# EAGLE board trailmon (EAGLE 7.5.0)
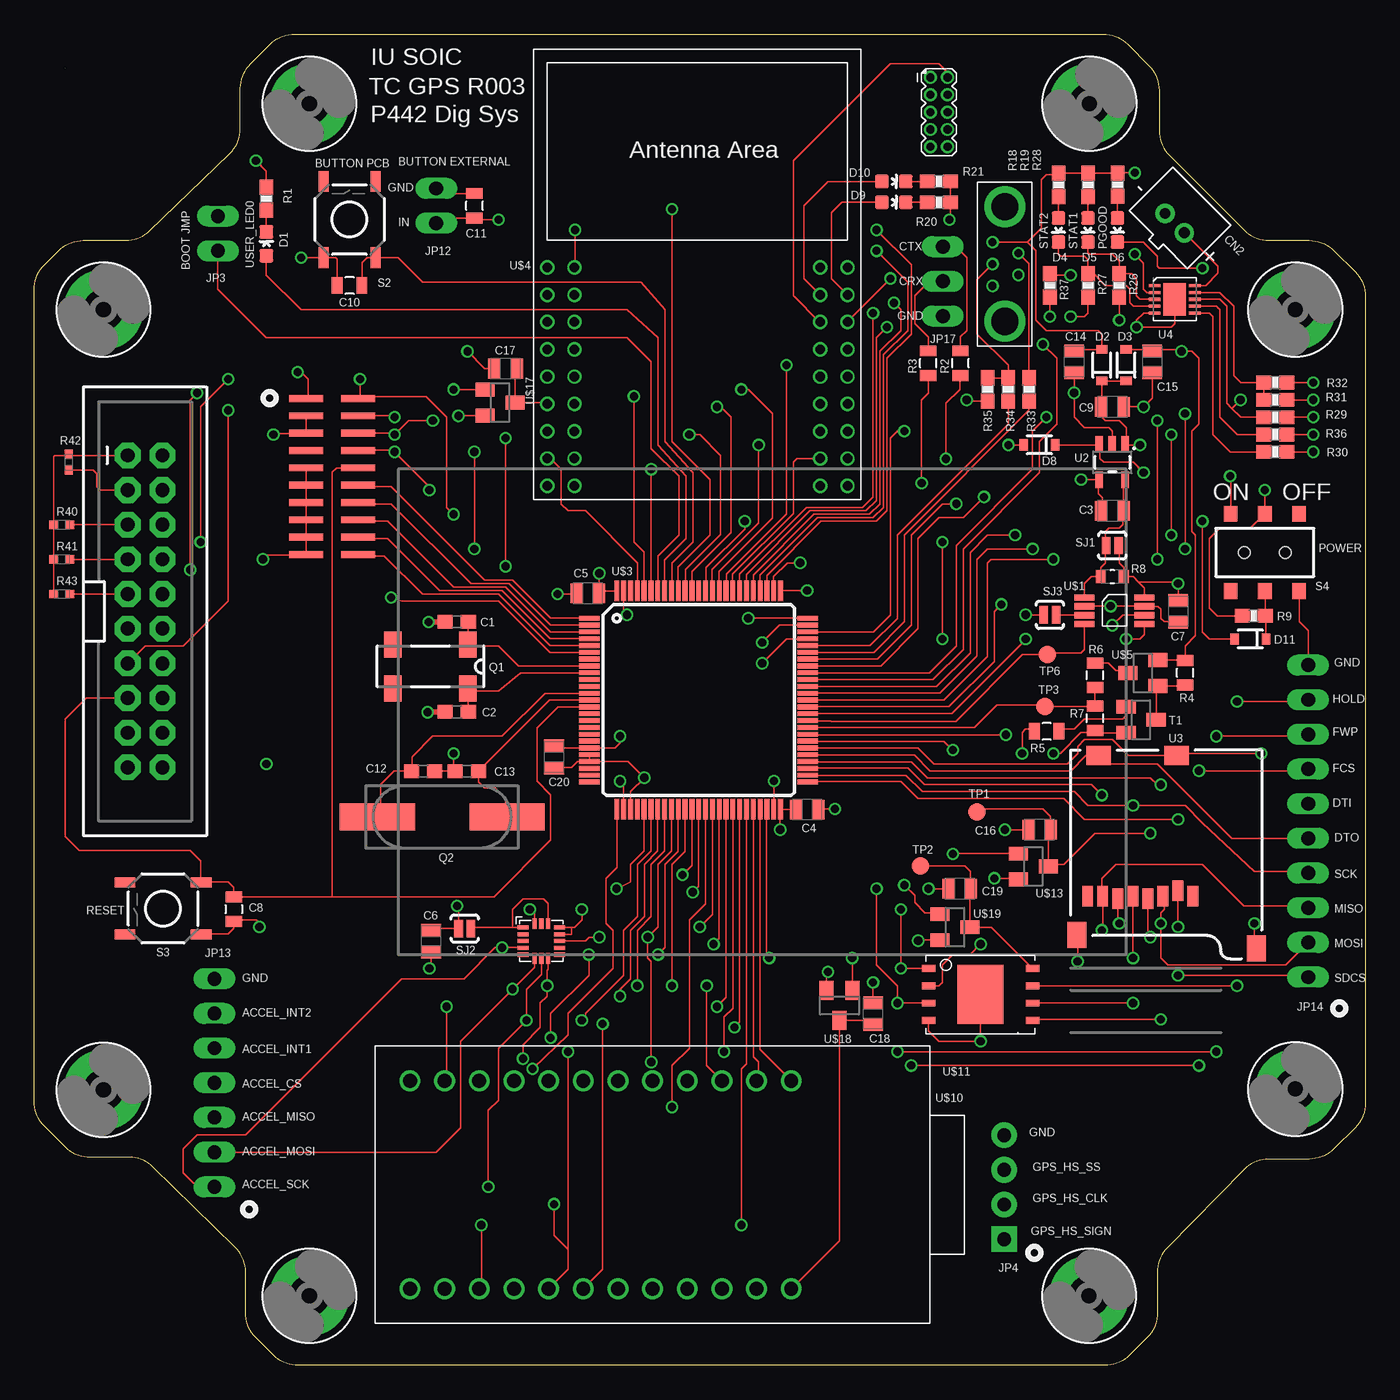
[diagram p7: board, top side]
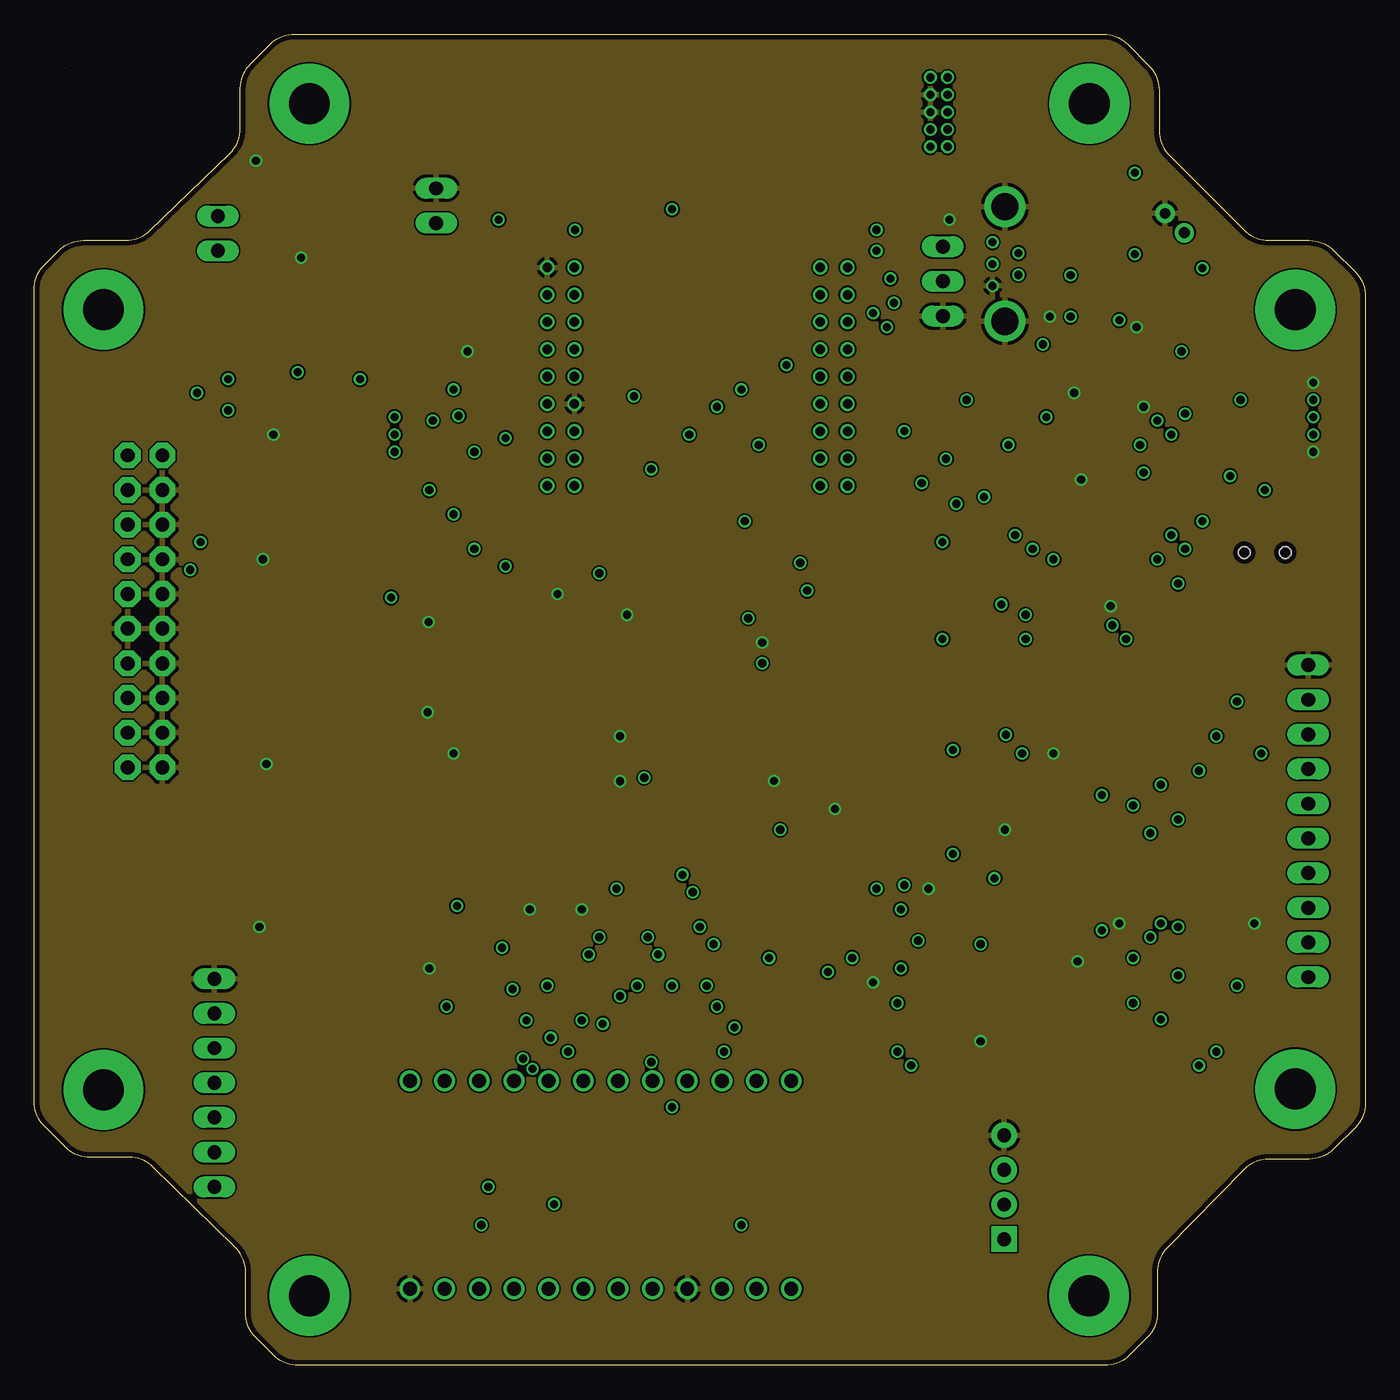
[diagram p8: board, inner layer Route2]
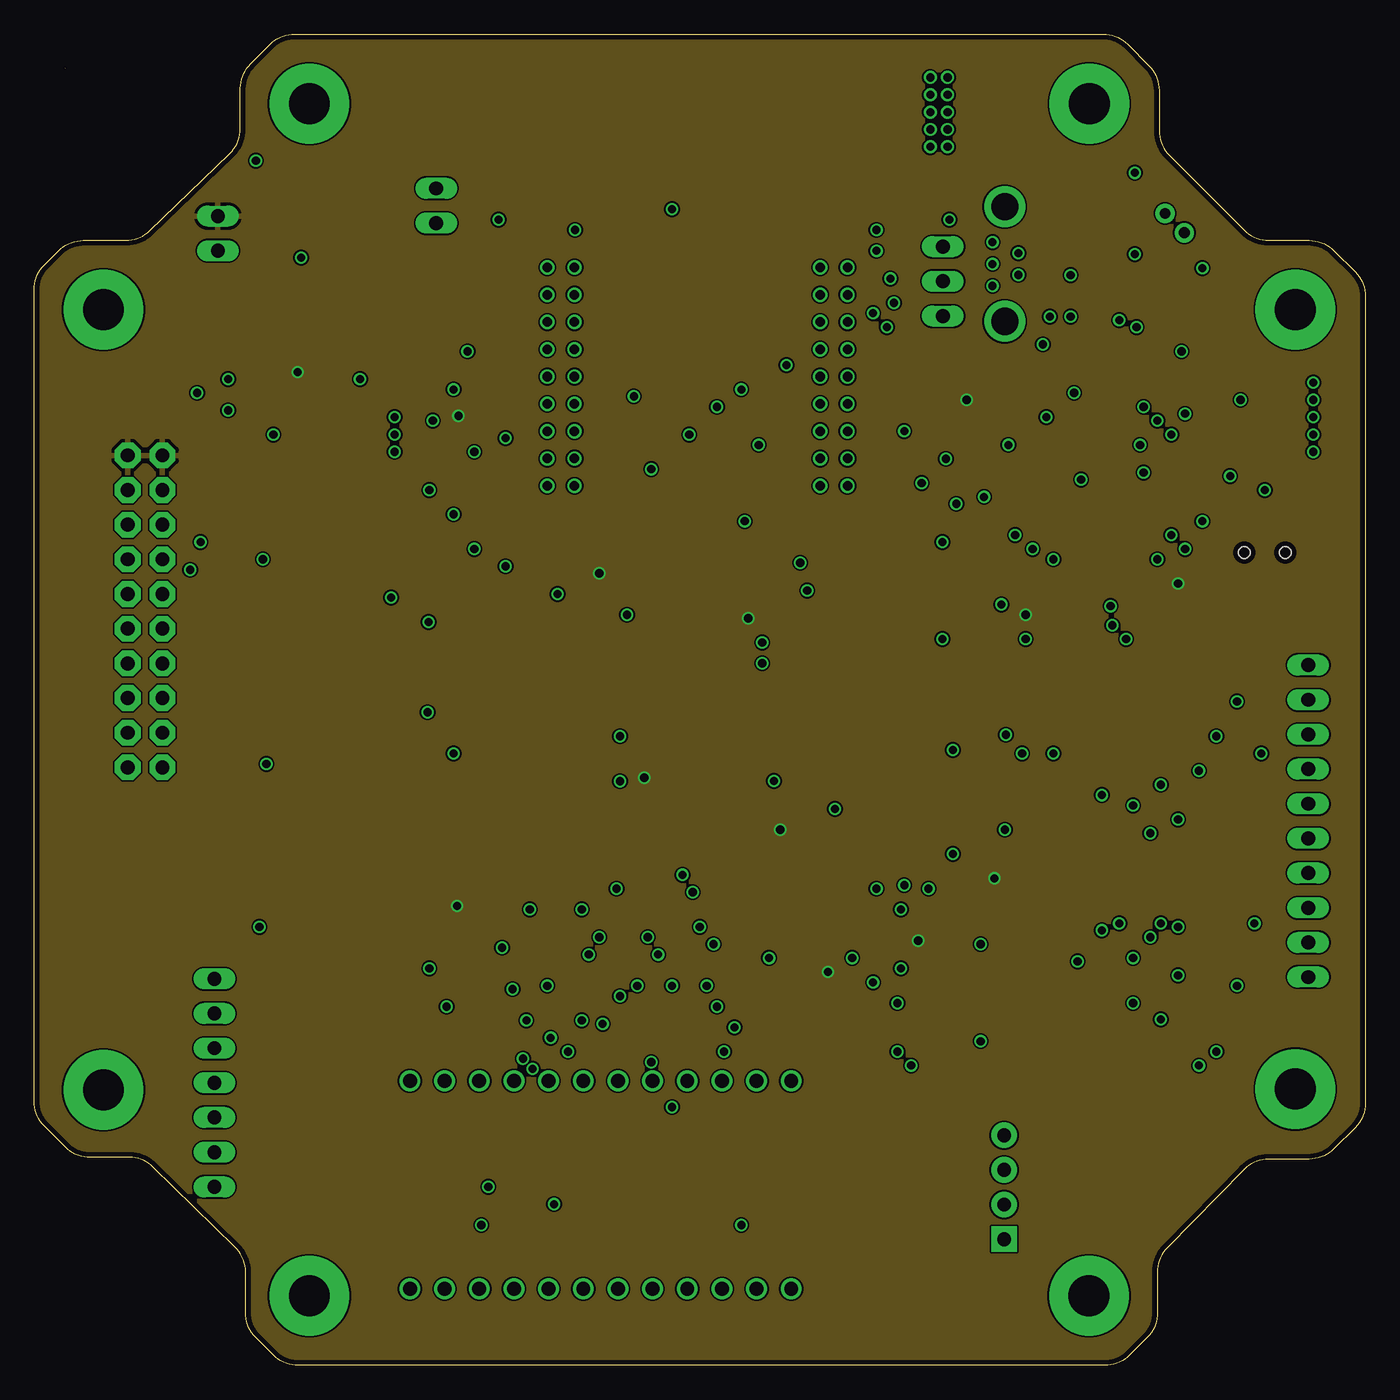
[diagram p9: board, inner layer Route15]
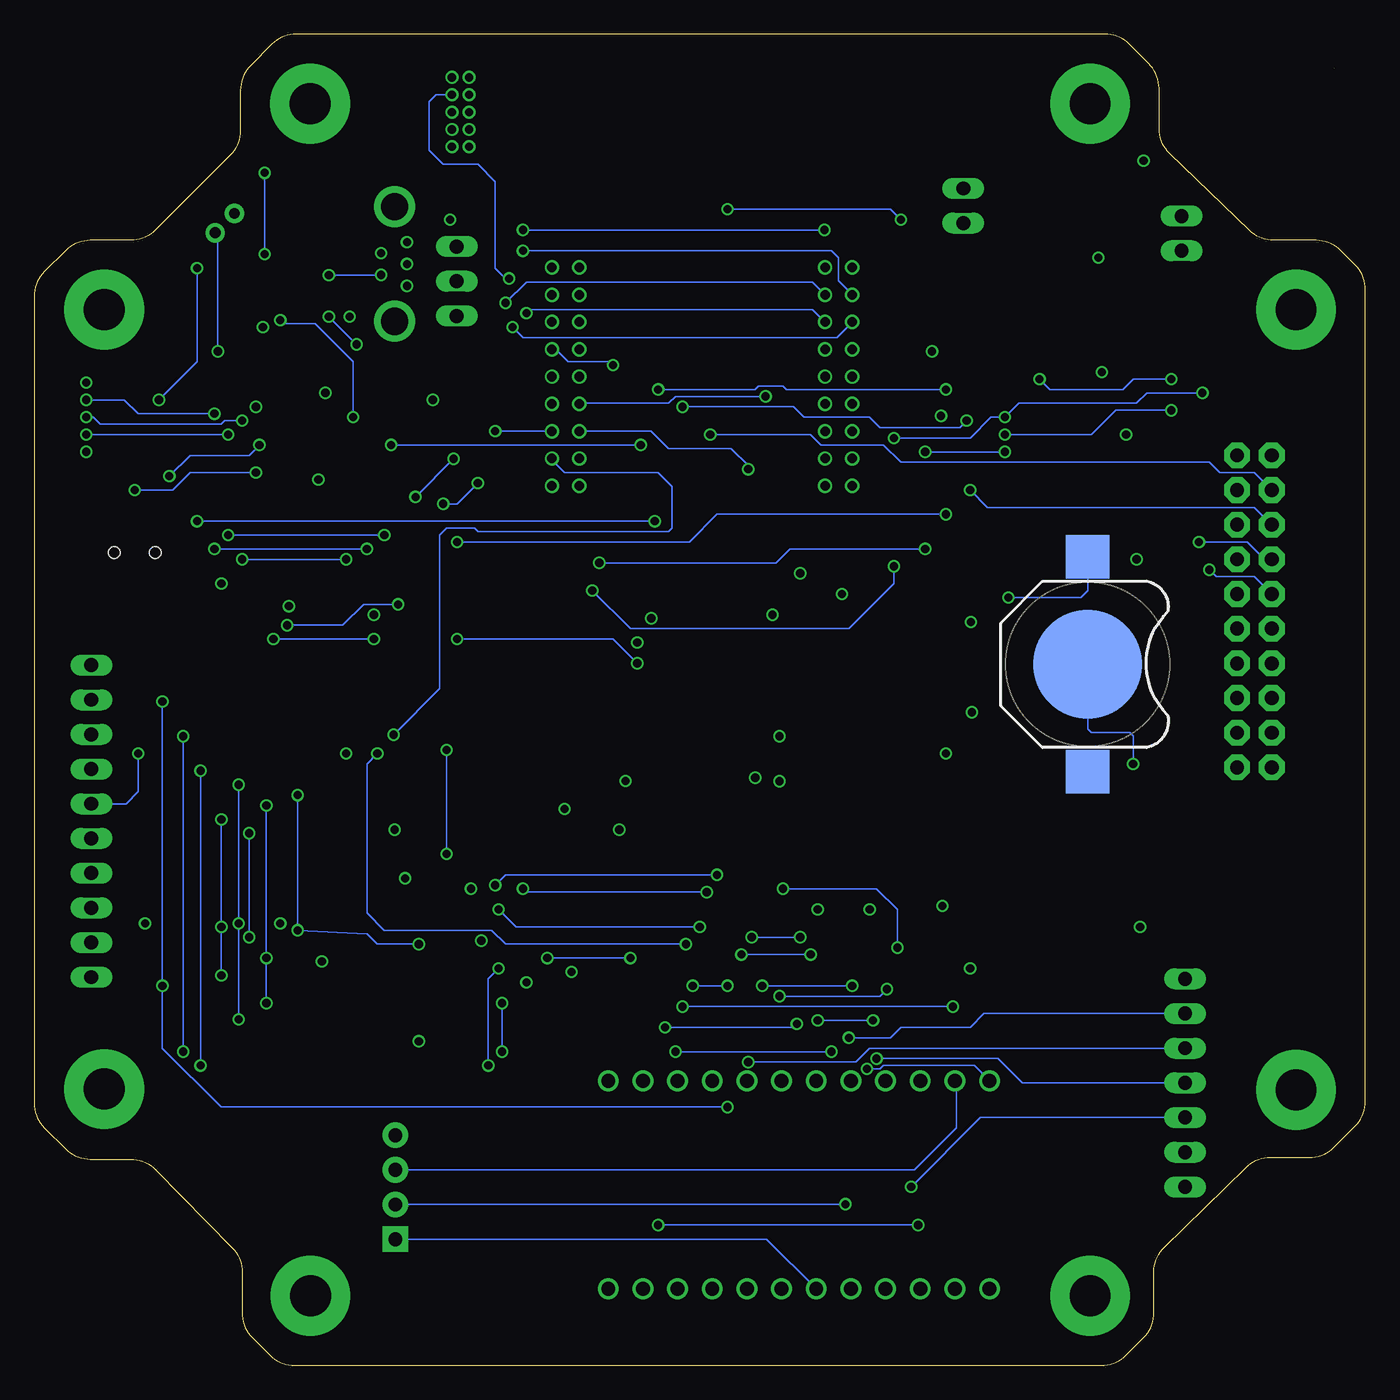
[diagram p10: board, bottom side, seen from below]

Size 97.54 x 97.54 mm. Coordinates in mm from the lower left corner, seen from the top.
Outline: 2.29,95.05 arc0 2.29,95.05
Outline: 83.17,88.66 88.66,83.17 arc45 90.46,82.42 93.44,82.42 arc-45 95.23,81.68 96.79,80.12 arc-45 97.54,78.32 97.54,19.21 arc-45 96.79,17.42 95.23,15.86 arc-45 93.44,15.11 90.46,15.11 arc45 88.66,14.37 88.66,14.36 arc1 88.64,14.34 83.02,8.62 arc44 82.3,6.84 82.3,3.85 arc-45 81.55,2.05 80.25,0.74 arc-45 78.45,0 19.34,0 arc-45 17.54,0.74 16.24,2.05 arc-45 15.49,3.85 15.49,6.84 arc46 14.73,8.65 8.74,14.52 arc44 6.96,15.24 4.1,15.24 arc-45 2.3,15.98 0.74,17.54 arc-45 0,19.34 0,78.83 arc-45 0.74,80.63 1.8,81.68 arc-45 3.59,82.42 6.72,82.42 arc44 8.48,83.14 14.34,88.79 arc46 15.11,90.61 15.11,93.56 arc-45 15.86,95.36 17.29,96.79 arc-45 19.09,97.54 78.32,97.54 arc-45 80.12,96.79 81.68,95.23 arc-45 82.42,93.44 82.42,90.46 arc45 83.17,88.66
Copper layers (1*2*15*16): Top 0.035559375mm / dielectric 0.17018125mm / Route2 0.01778125mm / dielectric 47mil / Route15 0.01778125mm / dielectric 0.17018125mm / Bottom 0.035559375mm
Design rules "OSHPark-4layer": minimum track width 5mil, minimum drill 10mil, track to track 5mil, track to pad 5mil, pad to pad 5mil, via to via 5mil, smd to smd 5mil, copper to edge 15mil, drill to drill 6mil, minimum pad ring 4mil, minimum via ring 4mil, stop-mask expansion 2.5mil, vias tented up to drill 0mil, thermal gap 10mil

## Footprints (pad centres in the part's own frame; a part is rotated, then mirrored left to right if it is on the bottom)
BATTCON_12MM = smd 8 x 8: GND 0,0 | smd 3.175 x 3.175: PWR@1 -7.874,0; PWR@2 7.874,0
0603-CAP = smd 1.1 x 1: 1 -0.85,0; 2 0.85,0
CAPC2013X110N = smd 0.914 x 1.448: 1 -0.813,0; 2 0.813,0
CAPC2013X88N = smd 0.914 x 1.448: 1 -0.813,0; 2 0.813,0
0805 = smd 0.8 x 1.2: 1 -0.9,0; 2 0.9,0
JST-PH-2-THM = drill 0.8 pad 1.422: 1 1,0; 2 -1,0
LED-0603 = smd 1 x 1: A 0,-0.877; C 0,0.877
SOD-323 = smd 0.63 x 0.83: A 1.15,0; C -1.15,0
3,0-PAD = drill 3 pad 5.842: B3,0 0,0
1X02 = drill 1.016 long: 1 -1.27,0; 2 1.27,0
1X04 = drill 1.016 pad 1.88 square: 1 0,0 | drill 1.016 pad 1.88: 2 2.54,0; 3 5.08,0; 4 7.62,0
1X07 = drill 1.016 long: 1 -7.62,0; 2 -5.08,0; 3 -2.54,0; 4 0,0; 5 2.54,0; 6 5.08,0; 7 7.62,0
1X10 = drill 1.016 long: 1 -11.43,0; 2 -8.89,0; 3 -6.35,0; 4 -3.81,0; 5 -1.27,0; 6 1.27,0; 7 3.81,0; 8 6.35,0; 9 8.89,0; 10 11.43,0
1X03 = drill 1.016 long: 1 -2.54,0; 2 0,0; 3 2.54,0
MC-306 = smd 1.3 x 1.9: 1 -2.75,-1.6; 2 2.75,-1.6; 3 2.75,1.6; 4 -2.75,1.6
CSM-7X-DU = smd 5.5 x 2: 1 -4.75,0; 2 4.75,0
0603-RES = smd 1.1 x 1: 1 -0.85,0; 2 0.85,0
RESC1608X60N = smd 0.762 x 0.94: 1 -0.838,0; 2 0.838,0
RESC1005X40N = smd 0.66 x 0.61: 1 -0.584,0; 2 0.584,0
TACTILE-SWITCH-SMD = smd 1.524 x 0.762: 1 -2.794,1.905; 2 2.794,1.905; 3 -2.794,-1.905; 4 2.794,-1.905
AYZ0202 = smd 1 x 1.15: 1 -2.5,2.825; 2 0,2.825; 3 2.5,2.825; 4 -2.5,-2.825; 5 0,-2.825; 6 2.5,-2.825 | hole 0.85: 1.5,0; -1.5,0
PAD-JUMPER-2-NO_YES_SILK = smd 0.635 x 1.27: 1 -0.45,0; 2 0.45,0
SOT23 = smd 1 x 1.4: 1 -0.95,-1.1; 2 0.95,-1.1; 3 0,1.1
B1,27 = smd 1.27 x 1.27: TP 0,0
ADXL362 = smd 0.8 x 0.3: P$1 -1.35,1; P$2 -1.35,0.5; P$3 -1.35,0; P$4 -1.35,-0.5; P$5 -1.35,-1; P$9 1.35,-1; P$10 1.35,-0.5; P$11 1.35,0; P$12 1.35,0.5; P$13 1.35,1 | smd 0.3 x 0.8: P$6 -0.5,-1.275; P$7 0,-1.275; P$8 0.5,-1.275; P$14 0.5,1.275; P$15 0,1.275; P$16 -0.5,1.275
SOT23-5 = smd 0.55 x 1.2: 1 -0.95,-1.3; 2 0,-1.3; 3 0.95,-1.3; 4 0.95,1.3; 5 -0.95,1.3
MICRO-SD-SOCKET-PP = smd 1.8 x 1.4: CD1 -2.05,0.4; CD2 -7.75,0.4 | smd 0.8 x 1.5: CS -7.84,10.3; DI -6.74,10.7; DO -2.34,10.7; GND -3.44,10.9; RSV1 -8.94,10.7; RSV2 -1.24,10.7; SCLK -4.54,10.7; VCC -5.64,10.9 | smd 1.4 x 1.9: GND1 -13.6,14.55; GND3 -0.45,13.55
DRC-10 = smd 0.23 x 0.85: 1 1,1.475; 2 0.5,1.475; 3 0,1.475; 4 -0.5,1.475; 5 -1,1.475; 6 -1,-1.475; 7 -0.5,-1.475; 8 0,-1.475; 9 0.5,-1.475; 10 1,-1.475 | smd 2.4 x 1.65: EP 0,0
MSOP-8 = smd 1.45 x 0.45: P$1 0.75,0; P$2 0.75,-0.65; P$3 0.75,-1.3; P$4 0.75,-1.95; P$5 5.15,-1.95; P$6 5.15,-1.3; P$7 5.15,-0.65; P$8 5.15,0
2X10_0.05"_SMD_NS = smd 0.5 x 2.5: 1 -5.715,-1.905; 2 -5.715,1.905; 3 -4.445,-1.905; 4 -4.445,1.905; 5 -3.175,-1.905; 6 -3.175,1.905; 7 -1.905,-1.905; 8 -1.905,1.905; 9 -0.635,-1.905; 10 -0.635,1.905; 11 0.635,-1.905; 12 0.635,1.905; 13 1.905,-1.905; 14 1.905,1.905; 15 3.175,-1.905; 16 3.175,1.905; 17 4.445,-1.905; 18 4.445,1.905; 19 5.715,-1.905; 20 5.715,1.905
TQFP100 = smd 1.5 x 0.35: 1 -8,6; 2 -8,5.5; 3 -8,5; 4 -8,4.5; 5 -8,4; 6 -8,3.5; 7 -8,3; 8 -8,2.5; 9 -8,2; 10 -8,1.5; 11 -8,1; 12 -8,0.5; 13 -8,0; 14 -8,-0.5; 15 -8,-1; 16 -8,-1.5; 17 -8,-2; 18 -8,-2.5; 19 -8,-3; 20 -8,-3.5; 21 -8,-4; 22 -8,-4.5; 23 -8,-5; 24 -8,-5.5; 25 -8,-6; 51 8,-6; 52 8,-5.5; 53 8,-5; 54 8,-4.5; 55 8,-4; 56 8,-3.5; 57 8,-3; 58 8,-2.5; 59 8,-2; 60 8,-1.5; 61 8,-1; 62 8,-0.5; 63 8,0; 64 8,0.5; 65 8,1; 66 8,1.5; 67 8,2; 68 8,2.5; 69 8,3; 70 8,3.5; 71 8,4; 72 8,4.5; 73 8,5; 74 8,5.5; 75 8,6 | smd 0.35 x 1.5: 26 -6,-8; 27 -5.5,-8; 28 -5,-8; 29 -4.5,-8; 30 -4,-8; 31 -3.5,-8; 32 -3,-8; 33 -2.5,-8; 34 -2,-8; 35 -1.5,-8; 36 -1,-8; 37 -0.5,-8; 38 0,-8; 39 0.5,-8; 40 1,-8; 41 1.5,-8; 42 2,-8; 43 2.5,-8; 44 3,-8; 45 3.5,-8; 46 4,-8; 47 4.5,-8; 48 5,-8; 49 5.5,-8; 50 6,-8; 76 6,8; 77 5.5,8; 78 5,8; 79 4.5,8; 80 4,8; 81 3.5,8; 82 3,8; 83 2.5,8; 84 2,8; 85 1.5,8; 86 1,8; 87 0.5,8; 88 0,8; 89 -0.5,8; 90 -1,8; 91 -1.5,8; 92 -2,8; 93 -2.5,8; 94 -3,8; 95 -3.5,8; 96 -4,8; 97 -4.5,8; 98 -5,8; 99 -5.5,8; 100 -6,8
WS_CORE51822 = drill 0.7: P$1 0,0; P$2 2,0; P$3 0,-2; P$4 2,-2; P$5 0,-4; P$6 2,-4; P$7 0,-6; P$8 2,-6; P$9 0,-8; P$10 2,-8; P$11 0,-10; P$12 2,-10; P$13 0,-12; P$14 2,-12; P$15 0,-14; P$16 2,-14; P$17 0,-16; P$18 2,-16; P$19 20,-16; P$20 22,-16; P$21 20,-14; P$22 22,-14; P$23 20,-12; P$24 22,-12; P$25 20,-10; P$26 22,-10; P$27 20,-8; P$28 22,-8; P$29 20,-6; P$30 22,-6; P$31 20,-4; P$32 22,-4; P$33 20,-2; P$34 22,-2; P$35 20,0; P$36 22,0
MINI-B-VERTICAL-WURTH = drill 0.6: P$1 1.4,-0.9; P$2 2.2,1; P$3 3,-0.9; P$4 3.8,1; P$5 4.6,-0.9 | drill 2: P$6 -1.2,0; P$7 7.2,0
NAVSPARK_ARDUINO = drill 1.016: P$1 0,0; P$2 0,-2.54; P$3 0,-5.08; P$4 0,-7.62; P$5 0,-10.16; P$6 0,-12.7; P$7 0,-15.24; P$8 0,-17.78; P$9 0,-20.32; P$10 0,-22.86; P$11 0,-25.4; P$12 0,-27.94; P$13 15.24,-27.94; P$14 15.24,-25.4; P$15 15.24,-22.86; P$16 15.24,-20.32; P$17 15.24,-17.78; P$18 15.24,-15.24; P$19 15.24,-12.7; P$20 15.24,-10.16; P$21 15.24,-7.62; P$22 15.24,-5.08; P$23 15.24,-2.54; P$24 15.24,0
WSON-8 = smd 1 x 0.5: P$1 0,0; P$2 0,-1.27; P$3 0,-2.54; P$4 0,-3.81; P$5 7.62,-3.81; P$6 7.62,-2.54; P$7 7.62,-1.27; P$8 7.62,0 | smd 3.4 x 4.3: P$9 3.8,-1.91
2X10_0.1"_TH_SH = drill 1.016 pad 1.88 octagon: 1 -1.27,5.08; 2 1.27,5.08; 3 -1.27,2.54; 4 1.27,2.54; 5 -1.27,0; 6 1.27,0; 7 -1.27,-2.54; 8 1.27,-2.54; 9 -1.27,-5.08; 10 1.27,-5.08; 11 -1.27,-7.62; 12 1.27,-7.62; 13 -1.27,-10.16; 14 1.27,-10.16; 15 -1.27,-12.7; 16 1.27,-12.7; 17 -1.27,-15.24; 18 1.27,-15.24; 19 -1.27,-17.78; 20 1.27,-17.78
2X5_0.05"_TH_NS = drill 0.6 pad 0.95: 1 -2.54,-0.635; 2 -2.54,0.635; 3 -1.27,-0.635; 4 -1.27,0.635; 5 0,-0.635; 6 0,0.635; 7 1.27,-0.635; 8 1.27,0.635; 9 2.54,-0.635; 10 2.54,0.635

## Placement (x,y rotation side)
BAT4  3V  [BATTCON_12MM]  20.35,51.36 270 bottom
C1  6.8pf  [0603-CAP]  30.96,54.48 180 top
C2  6.8pf  [0603-CAP]  30.96,47.88 180 top
C3  1uF  [CAPC2013X110N]  78.99,62.61 180 top
C4  10nF  [CAPC2013X88N]  56.64,40.72 180 top
C5  10nF  [CAPC2013X88N]  40.56,56.57 0 top
C6  10nF  [CAPC2013X88N]  29.08,31.09 90 top
C7  10nF  [CAPC2013X88N]  83.82,55.25 270 top
C8  100pf  [0805]  14.63,33.43 270 top
C9  1uF  [CAPC2013X110N]  78.99,70.23 0 top
C10  100pf  [0805]  23.11,79.12 180 top
C11  100pf  [0805]  32.26,84.96 90 top
C12  20pf  [0603-CAP]  28.5,43.54 0 top
C13  20pf  [0603-CAP]  31.7,43.54 180 top
C14  1uF  [CAPC2013X110N]  76.2,73.53 270 top
C15  1uF  [CAPC2013X110N]  81.91,73.53 270 top
C16  10nF  [CAPC2013X88N]  73.66,39.24 0 top
C17  10nF  [CAPC2013X88N]  34.54,73.03 0 top
C18  10nF  [CAPC2013X88N]  61.47,25.78 270 top
C19  10nF  [CAPC2013X88N]  67.82,34.92 0 top
C20  10nF  [CAPC2013X88N]  38.1,44.58 270 top
CN2  [JST-PH-2-THM]  83.57,83.69 315 top
D1  BLUE  [LED-0603]  17.02,82.17 0 top
D2  250mA/100V  [SOD-323]  78.23,73.28 90 top
D3  250mA/100V  [SOD-323]  80.01,73.28 90 top
D4  BLUE  [LED-0603]  75.06,83.19 180 top
D5  BLUE  [LED-0603]  77.22,83.19 180 top
D6  BLUE  [LED-0603]  79.38,83.19 180 top
D8  250mA/100V  [SOD-323]  73.66,67.44 180 top
D9  BLUE  [LED-0603]  62.99,85.22 270 top
D10  BLUE  [LED-0603]  62.99,86.74 270 top
D11  250mA/100V  [SOD-323]  89.1,53.21 180 top
H1  MOUNT-PAD-ROUND3.0  [3,0-PAD]  5.08,20.19 0 top
H2  MOUNT-PAD-ROUND3.0  [3,0-PAD]  20.17,5.11 0 top
H3  MOUNT-PAD-ROUND3.0  [3,0-PAD]  77.29,5.11 0 top
H4  MOUNT-PAD-ROUND3.0  [3,0-PAD]  92.41,20.24 0 top
H5  MOUNT-PAD-ROUND3.0  [3,0-PAD]  92.41,77.34 0 top
H6  MOUNT-PAD-ROUND3.0  [3,0-PAD]  77.32,92.43 0 top
H7  MOUNT-PAD-ROUND3.0  [3,0-PAD]  20.17,92.43 0 top
H8  MOUNT-PAD-ROUND3.0  [3,0-PAD]  5.08,77.34 0 top
JP3  [1X02]  13.46,82.93 270 top
JP4  [1X04]  71.07,9.25 90 top
JP12  [1X02]  29.46,84.96 90 top
JP13  [1X07]  13.21,20.7 90 top
JP14  [1X10]  93.34,39.88 90 top
JP17  [1X03]  66.57,79.43 270 top
Q1  MC-306  [MC-306]  29.03,51.21 180 top
Q2  ECS-80-20-5PVX  [CSM-7X-DU]  29.9,40.18 0 top
R1  200  [0603-RES]  17.02,85.47 270 top
R2  300  [0805]  67.87,73.43 90 top
R3  300  [0805]  65.51,73.43 90 top
R4  100k  [0805]  84.33,50.75 90 top
R5  10k  [0805]  74.19,46.46 180 top
R6  4.7k  [0805]  77.72,50.57 90 top
R7  1k  [0805]  77.72,47.42 90 top
R8  10 Ohms  [RESC1608X60N]  78.99,57.78 0 top
R9  10k  [0603-RES]  89.36,54.91 180 top
R18  200  [0603-RES]  75.06,86.49 90 top
R19  200  [0603-RES]  77.22,86.49 90 top
R20  200  [0603-RES]  66.29,85.22 180 top
R21  200  [0603-RES]  66.29,86.74 180 top
R26  200  [0603-RES]  79.5,79.12 270 top
R27  200  [0603-RES]  77.22,79.12 270 top
R28  200  [0603-RES]  79.38,86.51 90 top
R29  200  [0603-RES]  90.93,69.47 0 top
R30  1.13k  [0603-RES]  90.93,66.93 180 top
R31  200  [0603-RES]  90.93,70.74 0 top
R32  20k  [0603-RES]  90.93,72.01 180 top
R33  33  [0603-RES]  72.9,71.5 270 top
R34  33  [0603-RES]  71.37,71.5 270 top
R35  1.5k  [0603-RES]  69.85,71.5 270 top
R36  200  [0603-RES]  90.93,68.2 0 top
R37  100k  [0603-RES]  74.42,79.12 270 top
R40  100K Ohms  [RESC1005X40N]  2.03,61.59 0 top
R41  100K Ohms  [RESC1005X40N]  2.03,59.05 0 top
R42  100K Ohms  [RESC1005X40N]  2.54,66.17 270 top
R43  100K Ohms  [RESC1005X40N]  2.03,56.52 0 top
S2  SWITCH-MOMENTARY-2SMD  [TACTILE-SWITCH-SMD]  23.11,83.95 90 top
S3  SWITCH-MOMENTARY-2SMD  [TACTILE-SWITCH-SMD]  9.45,33.48 180 top
S4  DPDT  [AYZ0202]  90.17,59.56 0 top
SJ1  JUMPER-PAD-2-NOYES_SILK  [PAD-JUMPER-2-NO_YES_SILK]  78.99,60.07 180 top
SJ2  JUMPER-PAD-2-NOYES_SILK  [PAD-JUMPER-2-NO_YES_SILK]  31.55,32 0 top
SJ3  JUMPER-PAD-2-NOYES_SILK  [PAD-JUMPER-2-NO_YES_SILK]  74.42,54.99 0 top
T1  BC847  [SOT23]  81.1,47.29 270 top
TP1  TPB1,27  [B1,27]  69.06,40.54 0 top
TP2  TPB1,27  [B1,27]  64.95,36.58 0 top
TP3  TPB1,27  [B1,27]  74.04,48.29 0 top
TP6  TPB1,27  [B1,27]  74.24,52.07 0 top
U1  ADXL362  [ADXL362]  37.16,31.09 0 top
U2  LDO-TPS78233  [SOT23-5]  78.99,66.17 180 top
U3  USD-SOCKETNEW  [MICRO-SD-SOCKET-PP]  75.95,45.08 180 top
U4  BQ24022  [DRC-10]  83.57,78.1 90 top
U$1  INA225  [MSOP-8]  76.2,56.26 0 top
U$2  2X10_0.05"_CORTEX_DEBUG_WITH_ETMSMD_UNSHROUDED  [2X10_0.05"_SMD_NS]  21.84,65.13 270 top
U$3  STM32F303VCT6  [TQFP100]  48.69,48.74 0 top
U$4  WS_CORE51822  [WS_CORE51822]  37.59,80.44 0 top
U$5  IRLML9301TRPBF  [SOT23]  81.23,50.72 90 top
U$6  USB-MINI-B-VERTICAL-WURTH  [MINI-B-VERTICAL-WURTH]  71.12,83.69 270 top
U$10  NAVSPARK_ARDUINO  [NAVSPARK_ARDUINO]  55.47,20.85 270 top
U$11  GD5F1GQ4UCY1G  [WSON-8]  65.53,29.08 0 top
U$12  TRADITIONALJTAG/SWDTH_SHROUDED  [2X10_0.1"_TH_SH]  8.13,61.59 0 top
U$13  IRLML9301TRPBF  [SOT23]  73.2,36.55 270 top
U$15  2X5_0.05"_CORTEX_DEBUGTH_NOKEY_UNSHROUDED  [2X5_0.05"_TH_NS]  66.29,91.82 270 top
U$16  LIPO-OUTLINE1100  [LIPO-1100]  80.01,30.1 90 top
U$17  IRLML9301TRPBF  [SOT23]  34.14,70.54 270 top
U$18  IRLML9301TRPBF  [SOT23]  59,26.37 180 top
U$19  IRLML9301TRPBF  [SOT23]  67.46,32.11 270 top

## Tracks (layer width: path | path; a pad name or v marks a point on that pad's centre or on a via)
ACCEL_CS  (via drill 0.6)
  Top 0.127: U$3.33 46.19,37.68 45.21,36.7 45.21,32.89 44.2,31.88 v44.2,27.81 | v35.81,22.48 35.81,23.5 37.08,24.77 37.08,26.54 37.59,27.05 v37.59,27.81 37.59,28.93 37.67,29.01 37.67,29.81 U1.P$8
  Bottom 0.127: v44.2,27.81 v37.59,27.81 | JP13.4 25.15,20.7 26.92,22.48 v35.81,22.48
ACCEL_INT1  (via drill 0.6)
  Top 0.127: U$3.34 46.69,37.67 45.72,36.7 45.72,32.13 v44.96,31.37 44.96,29.84 45.21,29.59 v45.21,22.22 | v41.4,31.37 40.64,31.37 40.39,31.11 38.54,31.11 U1.P$11
  Bottom 0.127: v44.96,31.37 v41.4,31.37 | JP13.5 36.32,23.24 37.34,22.22 v45.21,22.22
ACCEL_INT2  (via drill 0.6)
  Top 0.127: U$3.35 47.19,37.67 46.23,36.7 46.23,30.61 v45.72,30.1 | U1.P$9 v40.64,30.1 40.64,28.58 37.85,25.78 v37.85,24
  Bottom 0.127: v45.72,30.1 v40.64,30.1 | JP13.6 27.94,25.78 28.96,24.77 34.04,24.77 34.8,24 v37.85,24
ACCEL_MISO  (via drill 0.6)
  Top 0.127: U$3.31 45.19,37.7 44.2,36.7 44.2,32.89 43.18,31.88 43.18,28.58 40.39,25.78 40.39,25.53 v40.13,25.27 | U1.P$7 37.16,28.65 36.07,27.56 v36.07,25.27 34.04,23.24 34.04,19.43 33.27,18.67 v33.27,13.08
  Bottom 0.127: v40.13,25.27 v36.07,25.27 | v33.27,13.08 28.19,18.16 JP13.3
ACCEL_MOSI  (via drill 0.6)
  Top 0.127: U$3.32 45.69,37.69 44.7,36.7 44.7,32.89 43.69,31.88 43.69,28.32 42.93,27.56 v42.93,27.05 | U1.P$6 36.65,29.81 36.65,29.16 v35.05,27.56 31.24,23.75 31.24,17.4 29.46,15.62 JP13.2
  Bottom 0.127: v42.93,27.05 35.56,27.05 v35.05,27.56
ACCEL_SCK  (via drill 0.6)
  Top 0.127: U$3.30 44.69,37.71 43.69,36.7 43.69,35.43 v42.67,34.92 | U1.P$4 35.79,30.61 v34.29,30.61 33.78,30.61 31.5,28.32 26.92,28.32 15.49,16.89 11.94,16.89 10.92,15.88 10.92,14.1 11.68,13.34 12.95,13.34 JP13.1
  Bottom 0.127: v42.67,34.92 35.81,34.92 34.29,33.4 v34.29,30.61
BOOT_MODE
  Top 0.127: U$3.94 45.72,56.77 45.72,59.31 47.24,60.83 47.24,65.15 45.21,67.18 45.21,73.53 43.43,75.31 17.02,75.31 13.46,78.87 JP3.2
BTLE_CS  (via drill 0.6)
  Top 0.127: U$3.81 52.19,57.96 56.84,62.61 60.96,62.61 61.72,63.37 61.72,75.31 v62.48,76.07
  Bottom 0.127: v62.48,76.07 61.72,75.31 38.72,75.31 U$4.P$5
BTLE_CTS  (via drill 0.6)
  Top 0.127: U$3.73 61.49,53.74 62.74,54.99 62.74,67.94 63.25,68.45 v63.75,68.45
  Bottom 0.127: v63.75,68.45 59.6,68.45 U$4.P$24
BTLE_DFU
  Top 0.127: U$3.83 51.18,56.75 51.18,57.96 55.63,62.41 55.63,66.17 55.9,66.44 U$4.P$21
BTLE_FACTORY_RESET  (via drill 0.6)
  Top 0.127: U$3.84 50.72,56.78 50.72,57.99 55.12,62.38 v55.12,73.28
  Bottom 0.127: v55.12,73.28 55.37,73.53 58.42,73.53 59.33,74.44 U$4.P$30
BTLE_INT  (via drill 0.6)
  Top 0.127: U$3.82 51.69,57.96 56.59,62.86 60.71,62.86 61.47,63.63 v61.47,77.09
  Bottom 0.127: v61.47,77.09 61.21,77.34 40.49,77.34 U$4.P$6
BTLE_MISO  (via drill 0.6)
  Top 0.127: U$3.79 53.19,57.89 57.4,62.1 61.47,62.1 62.23,62.86 62.23,74.04 64.01,75.82 64.01,79.38 v61.72,81.66
  Bottom 0.127: v61.72,81.66 39.12,81.66 38.61,81.15 38.61,79.46 U$4.P$3
BTLE_MODE
  Top 0.127: U$3.97 44.19,58.8 44.2,58.8 40.39,62.61 39.12,62.61 38.61,63.12 38.61,65.66 37.83,66.44 U$4.P$15
BTLE_MOSI  (via drill 0.6)
  Top 0.127: U$3.80 52.69,57.9 57.15,62.36 61.21,62.36 61.98,63.12 61.98,74.3 63.5,75.82 63.5,77.34 v62.99,77.85
  Bottom 0.127: v62.99,77.85 61.47,79.38 40.52,79.38 U$4.P$4
BTLE_POWER
  Top 0.127: U$4.P$11 37.5,70.54 U$17.3 35.24,72.91 C17.2
BTLE_POWER_EN  (via drill 0.6)
  Top 0.127: U$3.85 50.19,58.17 54.1,62.08 54.1,69.72 52.32,71.5 v51.82,71.5 | v30.73,71.5 33.02,71.5 U$17.1
  Bottom 0.127: v51.82,71.5 44.7,71.5 44.45,71.75 42.67,71.75 42.42,71.5 v30.73,71.5
BTLE_RTS  (via drill 0.6)
  Top 0.127: U$3.58 56.73,46.2 v71.2,46.2
  Bottom 0.127: v71.2,46.2 67.82,49.58 67.82,60.83 67.31,61.34 65.28,61.34 65.02,61.09 51.05,61.09 50.8,61.34 50.8,64.39 51.82,65.41 58.67,65.41 59.59,66.32 U$4.P$22
BTLE_RXD  (via drill 0.6)
  Top 0.127: U$3.96 44.69,59.58 43.94,60.33 v43.94,70.99
  Bottom 0.127: v43.94,70.99 50.55,70.99 51.05,70.48 57.55,70.48 U$4.P$25
BTLE_SCK  (via drill 0.6)
  Top 0.127: U$3.78 53.69,57.88 57.66,61.85 61.72,61.85 62.48,62.61 62.48,73.79 64.26,75.56 64.26,80.65 v61.72,83.19 | v39.62,83.19 39.62,80.47 U$4.P$2
  Bottom 0.127: v61.72,83.19 v39.62,83.19
BTLE_TX  (via drill 0.6)
  Top 0.127: U$3.95 45.21,56.76 v45.21,65.66
  Bottom 0.127: v45.21,65.66 45.21,65.91 46.48,67.18 51.05,67.18 52.32,68.45 57.58,68.45 U$4.P$23
BUTTON_EXTERNAL  (via drill 0.6)
  Top 0.127: U$3.91 47.19,58.5 49.53,60.83 49.53,64.9 46.74,67.69 v46.74,84.71 | v34.04,83.95 32.37,83.95 C11.1 29.83,84.06 JP12.1
  Bottom 0.127: v46.74,84.71 34.8,84.71 v34.04,83.95
BUTTON_PCB
  Top 0.127: U$3.92 46.74,56.79 46.74,58.8 48.26,60.33 48.26,65.41 46.23,67.69 46.23,77.34 44.45,79.38 28.45,79.38 26.67,81.15 S2.3 24.38,81.15 24.01,80.78 C10.1
CHARGER_CE  (via drill 0.6)
  Top 0.127: U$3.64 56.7,49.25 66.37,49.25 69.09,51.97 69.09,59.05 69.85,59.82 v73.15,59.82 | v84.33,59.82 v84.33,69.72 | v93.73,70.74 R31.2
  Bottom 0.127: v73.15,59.82 v84.33,59.82 | v84.33,69.72 89.92,69.72 90.93,70.74 v93.73,70.74
CHARGER_ISET2  (via drill 0.6)
  Top 0.127: U$3.65 66.13,49.74 68.58,52.2 68.58,59.56 69.85,60.83 v71.88,60.83 | v83.31,60.83 v83.31,68.2 | v93.73,68.2 R36.2
  Bottom 0.127: v71.88,60.83 v83.31,60.83 | v83.31,68.2 v93.73,68.2
CHARGER_PGOOD  (via drill 0.6)
  Top 0.127: U$3.63 56.72,48.77 63.45,48.77 63.48,48.74 66.65,48.74 69.85,51.94 69.85,58.8 70.1,59.05 v74.68,59.05 | v82.3,59.05 v82.3,69.22 | v93.73,69.47 R29.2
  Bottom 0.127: v74.68,59.05 v82.3,59.05 | v82.3,69.22 83.57,69.22 83.82,68.96 92.71,68.96 93.22,69.47 v93.73,69.47
CHARGER_STAT1  (via drill 0.6)
  Top 0.127: U$3.67 65.6,50.74 67.56,52.7 67.56,60.07 73.15,65.66 73.15,68.45 v74.17,69.47 | v79.5,76.58 R26.2
  Bottom 0.127: v74.17,69.47 74.17,73.53 76.96,76.33 79.25,76.33 v79.5,76.58
CHARGER_STAT2  (via drill 0.6)
  Top 0.127: U$3.66 65.86,50.24 68.07,52.45 68.07,59.82 73.66,65.41 73.66,67.69 74.93,68.96 74.93,73.79 v73.91,74.8 | v75.95,76.83 76.96,76.83 77.22,77.09 R27.2
  Bottom 0.127: v73.91,74.8 v75.95,76.83
CONNECTED_LED
  Top 0.127: U$4.P$34 59.59,78.46 58.42,79.63 58.42,84.46 59.18,85.22 D9.A
CONSOLE_RX  (via drill 0.6)
  Top 0.127: U$3.69 61.78,51.74 64.26,54.23 64.26,60.83 66.55,63.12 v67.56,63.12 | v65.02,64.64 65.02,70.74 65.53,71.25 65.53,72.51 R3.1
  Bottom 0.127: v67.56,63.12 66.55,63.12 v65.02,64.64
CONSOLE_TX  (via drill 0.6)
  Top 0.127: U$3.68 62.04,51.24 64.77,53.97 64.77,60.58 66.29,62.1 68.07,62.1 v69.6,63.63 | v66.8,66.42 66.8,70.48 67.82,71.5 67.82,72.48 R2.1
  Bottom 0.127: v69.6,63.63 v66.8,66.42
DEBUG_JTDI  (via drill 0.6)
  Top 0.127: R40.2 U$12.5 | U$3.77 54.18,56.76 54.18,57.78 55.19,58.8 v56.13,58.8 | v32.26,59.82 v32.26,66.93 | U$2.8 24.26,67.03 24.28,67.06 26.29,67.06 v26.42,66.93 28.96,64.39 v28.96,64.14
  Bottom 0.127: v56.13,58.8 43.18,58.8 42.16,59.82 v32.26,59.82 | v32.26,66.93 v26.42,66.93 | U$12.5 8.13,62.86 27.69,62.86 v28.96,64.14
DEBUG_JTDO_TRACESWO  (via drill 0.6)
  Top 0.127: U$12.13 8.13,52.7 10.92,52.7 14.22,56.01 v14.22,69.98 | U$2.6 26.31,68.3 v26.42,68.2 27.43,69.22 v29.21,69.22 | U$3.89 48.21,56.76 48.21,58.17 51.05,61.01 51.05,69.47 50.29,70.23 v50.04,70.23
  Bottom 0.127: v14.22,69.98 18.29,69.98 20.07,68.2 v26.42,68.2 | v50.04,70.23 49.78,70.23 | 49.78,70.23 50.04,69.98 50.29,69.98 | 49.78,70.23 41.91,70.23 41.15,69.47 36.32,69.47 35.56,68.71 29.72,68.71 v29.21,69.22
DEBUG_SWCLK_JTCK  (via drill 0.6)
  Top 0.127: R43.2 U$12.9 | U$3.76 54.72,56.77 v56.64,56.77 | v34.54,58.55 v34.54,67.94 | v26.42,69.47 26.31,69.57 U$2.4 | v11.43,58.29 11.43,70.74 v11.94,71.25
  Bottom 0.127: v56.64,56.77 53.85,53.97 37.85,53.97 34.54,57.28 v34.54,58.55 | v34.54,67.94 28.96,67.94 27.43,69.47 v26.42,69.47 25.4,70.48 16.76,70.48 16,71.25 v11.94,71.25 | U$12.9 8.13,57.78 10.92,57.78 v11.43,58.29
DEBUG_SWDIO_JTMS  (via drill 0.6)
  Top 0.127: R41.2 U$12.7 | v12.19,60.33 12.19,70.23 v14.22,72.26 | v23.88,72.26 23.88,70.97 | 23.88,70.97 U$2.2 | 23.88,70.97 28.73,70.97 30.23,69.47 30.23,62.86 v30.73,62.36 | v66.55,60.33 v66.55,53.21 | v53.34,51.44 55.12,53.21 56.66,53.21 U$3.72
  Bottom 0.127: U$12.7 7.37,59.05 8.64,60.33 v12.19,60.33 | v14.22,72.26 17.02,72.26 17.78,71.5 23.11,71.5 v23.88,72.26 | v30.73,62.36 47.5,62.36 49.53,60.33 v66.55,60.33 | v66.55,53.21 55.12,53.21 v53.34,51.44
DEBUG_TRACE_D0
  Top 0.127: U$2.14 23.85,63.12 26.16,63.12 32,57.28 34.8,57.28 37.83,54.24 U$3.2
DEBUG_TRACE_D1
  Top 0.127: U$2.16 23.85,61.85 25.91,61.85 30.73,57.02 34.54,57.02 37.82,53.74 U$3.3
DEBUG_TRACE_D2
  Top 0.127: U$2.18 23.85,60.58 25.91,60.58 29.72,56.77 34.29,56.77 37.82,53.24 U$3.4
DEBUG_TRACE_D3
  Top 0.127: U$2.20 23.85,59.31 25.65,59.31 28.45,56.52 34.04,56.52 37.81,52.74 U$3.5
DEBUG_TRACECLK
  Top 0.127: U$2.12 23.85,64.39 26.16,64.39 33.02,57.53 35.05,57.53 37.84,54.74 U$3.1
DEBUG_TRST  (via drill 0.6)
  Top 0.127: R42.2 2.56,65.61 4.32,65.61 4.57,65.35 4.57,64.39 4.83,64.14 U$12.3 | U$3.90 47.73,56.78 47.73,58.32 50.29,60.88 50.29,66.67 48.77,68.2 v48.01,68.2
  Bottom 0.127: v48.01,68.2 40.64,68.2 39.88,67.44 35.31,67.44 34.04,66.17 11.43,66.17 10.67,65.41 8.13,65.41 U$12.3
FLASH_CS  (via drill 0.6)
  Top 0.127: JP14.7 93.22,43.56 v85.34,43.56 | v85.34,21.97 v64.26,21.97 | U$11.P$1 v63.5,29.08 v63.5,33.4 | U$3.40 49.69,33.05 v48.77,32.13
  Bottom 0.127: v85.34,43.56 v85.34,21.97 | v64.26,21.97 64.26,28.32 v63.5,29.08 | v48.77,32.13 62.23,32.13 v63.5,33.4
FLASH_HOLD  (via drill 0.6)
  Top 0.127: JP14.9 93.22,48.64 v88.14,48.64 | v88.14,27.81 U$11.P$7 | U$3.39 49.19,33.83 48.01,32.64 48.01,23.24 46.74,21.97 v46.74,18.92
  Bottom 0.127: v88.14,48.64 v88.14,27.81 88.14,23.24 83.82,18.92 v46.74,18.92
FLASH_POWER
  Top 0.127: C19.2 68.58,34.87 | U$11.P$8 70.13,32.11 U$19.3 68.56,34.86 68.58,34.87 | 68.58,34.87 68.58,36.19 68.2,36.58 TP2.TP
FLASH_POWER_EN  (via drill 0.6)
  Top 0.127: U$3.37 48.19,36.64 v47.5,35.94 | v63.75,35.18 64.52,34.42 64.52,33.91 65.28,33.15 66.27,33.15 U$19.1
  Bottom 0.127: v47.5,35.94 62.99,35.94 v63.75,35.18
FLASH_WP  (via drill 0.6)
  Top 0.127: JP14.8 93.22,46.1 v86.61,46.1 | v86.61,22.99 v63.25,22.99 | U$11.P$3 v63.25,26.54 63.25,27.81 61.72,29.34 v61.72,34.92 | U$3.38 48.69,35.1 v48.26,34.67
  Bottom 0.127: v86.61,46.1 v86.61,22.99 | v63.25,22.99 v63.25,26.54 | v48.26,34.67 61.47,34.67 v61.72,34.92
GND  (via drill 0.6)
  Top 0.127: C5.1 39.7,56.52 v38.35,56.52 | 16.76,44.07 v17.02,44.07 | S3.1 12.29,31.62 14.22,31.62 14.63,32.03 C8.2 14.74,32.64 16.26,32.64 16.51,32.39 v16.51,32.13 | C12.2 C13.2 30.73,43.65 v30.73,44.83 | v16.76,59.05 16.81,59.05 17.14,59.39 19.91,59.39 U$2.19 U$2.17 U$2.15 U$2.13 U$2.11 U$2.9 | v17.53,68.2 17.6,68.28 19.91,68.28 U$2.5 U$2.3 | U$3.20 | U$3.99 43.18,56.73 43.18,55.25 v43.43,54.99 | U$3.74 56.68,54.23 54.61,54.23 v53.34,52.96 | C11.2 29.83,85.86 JP12.2 | C17.1 33.02,73.03 v31.75,74.3 | C10.2 22.21,81.04 22.1,81.15 S2.1 v19.56,81.15 | R1.1 17.02,87.5 v16.26,88.26 | R21.1 R20.1 67.14,84.03 v67.06,83.95 | R37.2 v74.42,76.83 | C14.2 v76.2,71.25 76.2,69.47 76.96,68.71 78.74,68.71 78.99,68.45 U2.2 | C9.2 v81.28,70.23 81.91,70.87 C15.2 | R32.1 v93.73,72.01 | U4.5 81.3,77.11 80.77,76.58 v80.77,76.07 83.31,76.07 83.57,76.33 U4.EP | v76.71,64.9 78.01,64.9 U2.4 77.98,64.8 77.98,63.88 78.28,63.58 78.28,63.37 78.18,63.27 C3.2 | S4.6 92.71,56.7 92.71,54.48 93.34,53.85 JP14.10 | C7.2 83.11,54.43 83.06,54.48 82.8,54.48 82.55,54.74 82.55,55.4 82.35,55.6 U$1.P$7 81.34,55.63 v78.87,55.63 76.94,55.63 U$1.P$2 | R7.1 77.89,46.36 | T1.2 77.9,46.34 77.89,46.36 | 77.89,46.36 76.71,46.36 75.18,44.83 v74.68,44.83 | C16.1 v71.12,39.24 | U3.GND3 76.45,31.48 v76.45,29.59 | U3.GND1 89.41,30.67 v89.41,32.39 | U3.GND 79.4,34.17 79.4,32.51 79.5,32.41 v79.5,32.39 | C19.1 v65.53,34.92 | U$11.P$9 v69.34,23.75 66.29,23.75 65.53,24.51 U$11.P$4 | C4.1 57.51,40.77 v58.67,40.77 | U$3.49 54.2,40.75 v54.2,42.82 | C18.1 v61.47,28.07 | U1.P$16 36.66,33.06 v36.32,33.4 | U1.P$13 39.37,32.09 | 39.37,32.09 39.58,32.09 40.13,32.64 v40.13,33.4
  Top 0.127: U1.P$12 39.34,31.59 39.37,31.62 39.37,32.09 | C6.1 29.08,29.21 v28.96,29.08 | U$3.27 43.19,42.53 v42.93,42.8 | U$3.20 38.25,45.24 C20.1 | U$3.20 42.58,45.24 42.93,45.59 v42.93,46.1 | R30.1 v93.73,66.93
  Top 0.406: C1.2 30.09,54.46 v28.91,54.46 | C2.2 30.09,47.85 v28.83,47.85
  Bottom 0.127: 38.1,56.77 v38.35,56.52 | BAT4.GND 20.32,51.36 20.32,46.61 20.07,46.36 17.27,46.36 17.02,46.1 v17.02,44.07 | v16.51,32.13 16.51,31.88 | v30.73,44.83 30.48,44.83 | 16.51,59.05 v16.76,59.05 | 17.27,67.94 v17.53,68.2 | v43.43,54.99 43.69,54.74 43.69,54.99 | v53.34,52.96 53.09,52.96 | 31.5,74.3 v31.75,74.3 32,74.3 | 19.3,81.15 v19.56,81.15 | v67.06,83.95 66.8,83.95 | v74.42,76.83 74.17,76.58 | v76.2,71.25 76.2,70.99 | v81.28,70.23 81.28,69.98 81.03,70.23 | v80.77,76.07 81.03,75.82 80.77,75.82 | v76.71,64.9 76.45,64.9 | v74.68,44.83 74.42,44.83 | v71.12,39.24 70.87,38.99 | v76.45,29.59 76.45,29.34 | v89.41,32.39 89.15,32.39 | 79.76,32.13 v79.5,32.39 | v65.53,34.92 65.28,34.92 | v69.34,23.75 69.09,23.75 | v58.67,40.77 58.93,41.02 | v54.2,42.82 54.1,42.93 | 54.1,42.93 54.1,43.05 | 54.1,42.93 54.1,42.8 | v61.47,28.07 61.21,28.32 | v36.32,33.4 36.07,33.4 | v40.13,33.4 39.88,33.4 | v28.96,29.08 28.7,29.08 | v42.93,42.8 42.67,42.8 | 42.93,46.36 v42.93,46.1 | v93.73,66.93 93.98,67.18
  Bottom 0.406: v28.91,54.46 28.85,54.46 28.85,54.43 | v28.83,47.85 28.78,47.8 28.75,47.8 28.8,47.85 28.85,47.85
  pour Route2: -7.32,102.26 -7.32,-2.87 105.05,-2.87 105.05,102.26
GPS_HS_CLK  (via drill 0.6)
  Top 0.127: U$3.43 51.19,26.17 50.55,25.53 v50.55,22.99 | v39.12,22.99 39.12,8.51 | 39.12,8.51 39.12,7.04 U$10.P$17 38.1,6.02 | v38.1,11.81 38.1,9.52 39.12,8.51
  Bottom 0.127: v50.55,22.99 v39.12,22.99 | JP4.2 38.12,11.79 v38.1,11.81
GPS_HS_SIGN  (via drill 0.6)
  Top 0.127: U$3.44 51.69,25.15 v51.31,24.77 | v41.66,25.02 41.66,7.04 U$10.P$18
  Bottom 0.127: v51.31,24.77 41.91,24.77 v41.66,25.02 | JP4.1 43.87,9.25 U$10.P$18
GPS_HS_SS  (via drill 0.6)
  Top 0.127: U$3.42 50.69,26.94 v50.04,26.29 | v30.23,26.29 30.23,21.01 U$10.P$11
  Bottom 0.127: v50.04,26.29 v30.23,26.29 | JP4.3 33.05,14.33 29.97,17.4 29.97,20.75 U$10.P$11
GPS_NMEA_TX  (via drill 0.6)
  Top 0.127: U$3.26 42.69,36.47 41.91,35.69 41.91,32.39 42.42,31.88 42.42,29.08 39.12,25.78 39.12,24.21 v36.52,21.72
  Bottom 0.127: v36.52,21.72 35.76,21.72 35.56,21.72 35.31,21.97 28.65,21.97 U$10.P$12
GPS_POWER
  Top 0.127: U$10.P$24 59,9.14 U$18.3 61.17,25.27 C18.2
GPS_POWER_EN  (via drill 0.6)
  Top 0.127: U$3.48 53.67,40.72 53.67,30.02 v53.85,29.84 | v59.94,29.84 U$18.1
  Bottom 0.127: v53.85,29.84 v59.94,29.84
GPS_PROG_RX
  Top 0.127: U$3.47 53.19,23.14 U$10.P$1
GPS_PROG_TX
  Top 0.127: U$3.46 52.69,22.62 53.09,22.22 53.09,21.01 U$10.P$2
GPS_SECOND  (via drill 0.6)
  Top 0.127: U$3.36 47.69,37.66 46.74,36.7 v46.74,27.81 | v49.28,27.81 49.28,21.97 U$10.P$3
  Bottom 0.127: v46.74,27.81 v49.28,27.81
GPS_TRIG_TIMESTAMP  (via drill 0.6)
  Top 0.127: U$3.45 52.19,22.09 51.82,21.72 v51.82,10.29 | v32.77,10.29 32.77,5.77 U$10.P$15
  Bottom 0.127: v51.82,10.29 v32.77,10.29
IMEAS_GAIN0_OUT  (via drill 0.6)
  Top 0.127: U$3.61 56.7,47.75 67.26,47.75 72.64,53.14 v72.64,53.21 | v80.01,53.21 81.03,53.21 81.35,53.54 U$1.P$5
  Bottom 0.127: v72.64,53.21 v80.01,53.21
IMEAS_GAIN1_OUT  (via drill 0.6)
  Top 0.127: U$3.62 56.71,48.26 67.03,48.26 70.36,51.59 70.36,55.25 v70.87,55.75 | v78.99,54.23 79.76,54.99 80.01,54.99 80.04,54.96 U$1.P$6
  Bottom 0.127: v70.87,55.75 73.41,55.75 74.93,54.23 v78.99,54.23
IMEAS_IN+
  Top 0.127: U$3.60 56.72,47.22 58.37,47.22 58.4,47.19 67.54,47.19 72.41,52.07 TP6.TP 74.37,52.2 76.71,52.2 76.95,52.44 U$1.P$4
LED_OUT0
  Top 0.127: U$3.93 46.19,59.02 47.75,60.58 47.75,65.15 45.72,67.44 45.72,75.31 43.43,77.34 19.56,77.34 17.02,79.88 D1.A
MODE_LED
  Top 0.127: U$4.P$33 57.58,78.44 56.39,79.63 56.39,84.96 58.17,86.74 D10.A
N$1
  Top 0.127: R5.1 75.25,46.61 76.2,46.61 76.96,47.37 79.76,47.37 80.01,47.62 80,47.63 T1.1
N$2
  Top 0.127: U4.4 82.08,77.6 80.52,77.6 80.26,77.85 80.26,78.87 80.01,79.12 78.49,79.12 77.64,79.97 R27.1 77.22,81.03 76.96,81.28 75.18,81.28 75.06,81.41 D4.C
N$3
  Top 0.127: R33.1 72.9,80.72 U$6.P$2
N$4
  Top 0.127: D1.C R1.2
N$5
  Top 0.127: R4.1 84.25,49.77 U$5.1 82.2,49.65 T1.3
N$11
  Top 0.127: S4.5 90.21,56.7 R9.1 90.25,54.87 D11.C
N$12
  Top 0.127: D9.C R20.2
N$20
  Top 0.127: R18.1 D4.A
N$21
  Top 0.127: U$5.3 79.93,50.93 79.25,50.93 78.7,51.47 R6.2
N$27
  Top 0.127: D10.C R21.2
N$28
  Top 0.127: R2.2 67.87,75.36 68.33,75.82 68.33,81.15 67.56,81.91 66.62,81.91 JP17.1
N$29
  Top 0.127: R3.2 65.51,75.34 64.52,76.33 64.52,78.36 65.53,79.38 66.52,79.38 JP17.2
N$34
  Top 0.127: 35.75,32.08 U1.P$1 35.05,32.09 | 35.05,32.09 32.08,32.09 SJ2.2 | U1.P$14 37.66,33.84 37.34,34.16 35.81,34.16 35.05,33.4 35.05,32.09
N$35
  Top 0.127: SJ3.2 74.9,54.96 U$1.P$3
N$38
  Top 0.127: U4.3 81.03,78.1 80.77,78.36 80.77,79.63 80.43,79.97 R26.1 79.5,80.9 78.99,81.41 77.34,81.41 77.22,81.53 D5.C
N$39
  Top 0.127: R19.1 D5.A
N$42
  Top 0.127: R28.1 D6.A
N$43  (via drill 0.6)
  Top 0.127: U4.8 86.87,78.1 87.38,77.6 87.38,70.48 87.76,70.1 | 87.76,70.1 88.39,69.47 R29.1 | v85.6,80.39 82.42,80.39 82.3,80.52 82.3,81.28 81.28,82.3 81.15,82.3 81.14,82.31 D6.C | v88.39,70.74 87.76,70.1
  Bottom 0.127: v85.6,80.39 85.6,73.53 v88.39,70.74
N$45
  Top 0.127: U4.6 86.09,77.11 86.36,76.83 86.36,68.2 87.63,66.93 R30.2
N$46
  Top 0.127: U4.9 86.86,78.6 86.87,78.61 87.88,77.6 87.88,72.52 88.39,72.01 R32.2 R31.1
N$48
  Top 0.127: U$6.P$3 69.09,79.56 69.09,75.56 71.37,73.28 R34.1 R35.1
N$49
  Top 0.127: U4.7 86.61,77.61 86.87,77.34 86.87,69.47 88.14,68.2 R36.1
N$51  (via drill 0.6)
  Top 0.127: v75.95,79.88 74.51,79.88 R37.1
  Bottom 0.127: U$6.P$4 75.94,79.89 v75.95,79.88
NRST
  Top 0.127: S3.3 12.29,35.43 | 12.29,35.43 14.22,35.43 14.63,35.03 C8.1 21.84,34.33 | 21.84,34.33 33.69,34.33 37.85,38.48 37.85,41.78 36.83,42.8 36.83,46.69 38.38,48.23 U$3.14 | 12.29,35.43 12.19,35.53 12.19,36.96 11.43,37.72 3.3,37.72 2.29,38.73 2.29,47.37 3.81,48.89 U$12.15 | U$2.10 23.72,65.73 22.15,65.73 21.84,65.43 21.84,34.33
RCC_OSC32_IN
  Top 0.127: C1.1 31.78,54.45 Q1.1 31.88,52.7 34.04,52.7 35.5,51.24 U$3.8
RCC_OSC32_OUT
  Top 0.127: C2.1 31.78,47.91 Q1.4 31.32,49.4 34.04,49.4 35.63,50.74 U$3.9
RCC_OSC_IN
  Top 0.127: U$3.12 37.43,49.24 34.29,46.1 29.21,46.1 27.69,44.58 27.69,43.57 C12.1 26.39,43.54 25.4,42.55 25.4,40.44 Q2.1
RCC_OSC_OUT
  Top 0.127: U$3.13 37.76,48.74 C13.1 32.55,42.76 33.02,42.29 33.78,42.29 34.54,41.53 34.54,40.28 Q2.2
REG_EN  (via drill 0.6)
  Top 0.127: D8.C 78.01,67.44 U2.3 78.08,67.43 78.08,66.45 78.36,66.17 80.52,66.17 v81.28,65.41 | v90.17,64.14 S4.2 89.12,61.34 86.87,61.34 86.11,60.58 86.11,55.5 86.69,54.91 R9.2
  Bottom 0.127: v81.28,65.41 86.11,65.41 87.38,64.14 v90.17,64.14
SD_POWER  (via drill 0.6)
  Top 0.127: C16.2 74.4,39.32 | C16.2 74.3,39.07 U$13.3 74.46,36.7 75.44,36.7 77.72,38.99 v81.79,38.99 | v81.79,31.37 81.59,31.57 U3.VCC | TP1.TP 69.29,40.77 73.91,40.77 74.47,40.21 C16.2
  Bottom 0.127: v81.79,38.99 v81.79,31.37
SDCARD_CS  (via drill 0.6)
  Top 0.127: U$3.51 56.72,42.77 63.52,42.77 64.77,41.53 75.44,41.53 76.96,40 v83.82,40 | v83.82,32.13 83.79,32.16 U3.CS | JP14.1 93.22,28.58 v83.82,28.58
  Bottom 0.127: v83.82,40 v83.82,32.13 v83.82,28.58
SDCARD_DETECT_IN  (via drill 0.6)
  Top 0.127: U$3.56 64.77,45.24 65.94,44.07 75.69,44.07 76.45,44.83 76.45,45.34 76.96,45.85 78.99,45.85 80.16,44.69 U3.CD2 83.84,44.83 v89.92,44.83
  Bottom 0.127: v89.92,44.83 89.92,42.04 90.81,41.15 JP14.6
SDCARD_DETECT_OUT
  Top 0.127: U$3.55 56.73,44.7 64.49,44.7 65.63,43.56 75.95,43.56 77.07,44.69 U3.CD1 78.61,44.07 82.3,44.07 87.76,38.61 JP14.5
SDCARD_MISO  (via drill 0.6)
  Top 0.127: U$3.53 56.71,43.76 64.01,43.76 65.23,42.55 77.47,42.55 v78.23,41.78 | v78.23,31.88 78.29,31.93 U3.DO 78.29,33.71 78.23,33.66 78.23,35.69 79.25,36.7 85.6,36.7 88.65,33.66 93.22,33.66 JP14.3 | v69.34,30.86 68.58,30.1 67.31,30.1 66.55,29.34 66.55,28.07 66.29,27.81 U$11.P$2
  Bottom 0.127: v78.23,41.78 v78.23,31.88 73.15,31.62 72.39,30.86 v69.34,30.86
SDCARD_MOSI  (via drill 0.6)
  Top 0.127: U$3.54 56.71,44.22 64.26,44.22 65.43,43.05 81.79,43.05 82.3,42.55 v82.55,42.55 | U3.DI 82.69,33.77 82.8,33.66 82.8,33.4 82.55,33.15 v82.55,32.39 82.55,29.84 83.06,29.34 91.69,29.34 JP14.2 | U$11.P$5 73.23,25.35 v82.55,25.35
  Bottom 0.127: v82.55,42.55 v82.55,32.39 v82.55,25.35
SDCARD_POWER_EN  (via drill 0.6)
  Top 0.127: U$3.57 56.71,45.72 66.65,45.72 67.28,45.08 v67.31,45.08 | v67.31,37.47 67.35,37.5 U$13.1
  Bottom 0.127: v67.31,45.08 v67.31,37.47
SDCARD_SCK  (via drill 0.6)
  Top 0.127: U$3.52 63.88,43.23 65.08,42.04 76.2,42.04 77.22,41.02 v80.52,41.02 84.33,41.02 85.6,39.75 89.41,36.19 93.47,36.19 JP14.4 | v80.52,29.84 80.49,29.88 U3.SCLK | U$11.P$6 v80.52,26.54
  Bottom 0.127: v80.52,41.02 v80.52,29.84 v80.52,26.54
SWDCLK  (via drill 0.6)
  Top 0.127: U$4.P$32 59.59,76.48 v62.74,79.63
  Bottom 0.127: v62.74,79.63 62.99,79.63 63.75,80.39 63.75,86.74 65.02,88.01 67.56,88.01 68.58,89.03 68.58,92.58 68.07,93.09 U$15.4
SWDIO
  Top 0.127: U$4.P$31 57.54,76.44 55.63,78.36 55.63,88.26 62.74,95.38 66.29,95.38 66.93,94.74 U$15.2
SYSTEM_POWER_LATCH  (via drill 0.6)
  Top 0.127: U$3.86 49.68,56.75 49.68,58.32 53.09,61.72 v53.09,67.44 | v71.37,67.44 D8.A
  Bottom 0.127: v53.09,67.44 v71.37,67.44
SYSTEM_POWER_SWITCH_STATE  (via drill 0.6)
  Top 0.127: U$3.87 49.23,56.78 49.23,58.44 52.07,61.29 v52.07,61.85 | v85.6,61.85 85.6,53.72 86.11,53.21 D11.A
  Bottom 0.127: 52.07,62.1 v52.07,61.85 v85.6,61.85
USB_DM
  Top 0.127: U$3.70 61.51,52.24 63.75,54.48 63.75,60.83 72.9,69.98 R33.2
USB_DP
  Top 0.127: U$3.71 61.25,52.74 63.25,54.74 63.25,60.83 71.37,68.96 R34.2
VBATT_BACKUP  (via drill 0.6)
  Top 0.127: v26.16,56.26 26.92,56.01 34.04,56.01 37.8,52.24 U$3.6
  Bottom 0.127: BAT4.PWR@1 20.32,59.21 20.32,56.77 20.83,56.26 v26.16,56.26
VCC
  Top 0.127: U2.5 79.81,64.73 C3.1 79.76,62.56 79.76,61.59 79.5,61.34 78.74,61.34 78.49,61.09 78.49,60.58 78.54,60.52 SJ1.2 78.49,60.01 78.49,58.8 78.16,58.47 R8.1 77.47,57.78 76.96,57.28 76.96,57.02 76.95,57.01 U$1.P$1
VDD  (via drill 0.6)
  Top 0.127: U$3.100 41.55,56.74 C5.2 41.4,56.59 v41.4,58.04 | U$3.21 U$3.22 | U$3.28 43.69,42.04 v44.7,43.05 43.51,44.24 U$3.22 | U$12.1 2.62,66.67 R42.1 2.46,66.67 1.52,66.67 1.45,66.6 R40.1 R41.1 R43.1 | U$17.2 33.02,69.57 v31.09,69.57 | U$2.1 20.07,70.97 20.07,72.26 19.56,72.77 v19.3,72.77 | U$3.75 v52.33,54.74 v52.32,54.74 | R35.2 68.41,70.65 v68.33,70.74 | SJ1.1 79.5,60.01 79.5,58.8 79.83,58.47 R8.2 80.52,57.78 80.9,57.4 | 80.9,57.4 81.35,56.95 U$1.P$8 | SJ3.1 v72.64,54.99 | C7.1 v83.82,57.28 83.69,57.4 80.9,57.4 | U$13.2 72.02,35.69 v70.36,35.69 | 55.83,40.74 U$3.50 54.66,40.71 v54.66,39.24 | U$18.2 58.05,28.72 v58.17,28.83 | U$19.2 64.81,31.16 v64.77,31.11 | C6.2 29.18,32 SJ2.1 31.1,33.55 v30.99,33.66 | U$3.22 39.8,44.24 39.37,43.81 38.15,43.81 C20.2
  Top 0.406: 55.83,40.74 C4.2
  Bottom 0.127: 41.15,58.29 v41.4,58.04 | v44.7,43.05 44.96,43.05 | v31.09,69.57 30.94,69.72 30.73,69.72 | 19.05,72.77 v19.3,72.77 | v52.32,54.74 52.07,54.74 | v68.33,70.74 68.07,70.48 | v72.64,54.99 72.64,54.74 | v70.36,35.69 70.1,35.69 | v54.66,39.24 54.86,39.24 | v58.17,28.83 58.17,29.08 | v64.77,31.11 64.52,31.37 | v30.99,33.66 30.73,33.66
  pour Route15: -7.21,102.36 -7.21,-2.84 105.03,-2.84 105.03,102.36
VIN_MEAS_A2D
  Top 0.127: R6.1 R7.2 77.69,48.28 TP3.TP 73.76,48.28 73.66,48.39 70.54,48.39 68.88,46.74 U$3.59
VIN_MEAS_EN  (via drill 0.6)
  Top 0.127: U$3.41 50.19,31.27 v49.78,30.86 | v72.39,44.83 72.39,46.36 72.64,46.61 73.14,46.61 R5.2
  Bottom 0.127: v49.78,30.86 62.99,30.86 64.01,31.88 71.88,31.88 73.15,33.15 73.15,44.07 v72.39,44.83
VLIPO  (via drill 0.6)
  Top 0.127: 80.64,74.43 D3.A 81.83,74.43 | 81.83,74.43 C15.1 | U4.10 85.06,79.12 85.85,79.12 86.74,80.01 86.74,80.52 CN2.1 | 81.83,74.43 83.94,74.43 v84.07,74.3 84.84,74.3 85.34,73.79 85.34,68.96 84.84,68.45 84.84,61.09 85.09,60.83 85.09,53.47 84.33,52.7 R4.2 84.3,51.67 U$5.2
  Bottom 0.127: v84.07,74.3 84.07,82.79 CN2.1
VPOWER  (via drill 0.6)
  Top 0.127: D3.C D2.C 78.23,70.28 | 78.23,70.28 C9.1 | 78.23,70.28 78.23,69.47 78.49,69.22 79.5,69.22 80.01,68.71 80.01,67.53 | 80.01,67.53 U2.1 | 80.01,67.53 80.11,67.44 v81.03,67.44 | v87.63,65.15 87.67,65.11 S4.1
  Bottom 0.127: v81.03,67.44 81.79,66.67 86.11,66.67 v87.63,65.15
VUSB  (via drill 0.6)
  Top 0.127: 72.77,82.29 U$6.P$1 72.77,82.29 | 72.77,82.29 73.41,81.66 73.41,76.58 74.17,75.82 77.98,75.82 78.23,75.56 D2.A 76.28,74.43 C14.1 | U4.2 81.54,78.6 81.28,78.87 81.28,80.77 v80.65,81.41 | 72.77,82.29 73.79,83.31 73.79,86.87 74.17,87.25 74.97,87.25 R18.2 R19.2 77.24,87.36 R28.2 79.39,87.38 v80.65,87.38
  Bottom 0.127: v80.65,81.41 v80.65,87.38

## Text on the board
tNames: IU SOIC | TC GPS R003 | P442 Dig Sys | BUTTON PCB | BUTTON EXTERNAL | GND | IN | CTX | STAT2 | STAT1 | PGOOD | BOOT JMP | USER_LED0 | CRX | GND | ON | OFF | POWER | GND | HOLD | FWP | FCS | DTI | DTO | SCK | RESET | MISO | MOSI | GND | SDCS | ACCEL_INT2 | ACCEL_INT1 | ACCEL_CS | ACCEL_MISO | GND | ACCEL_MOSI | GPS_HS_SS | ACCEL_SCK | GPS_HS_CLK | GPS_HS_SIGN